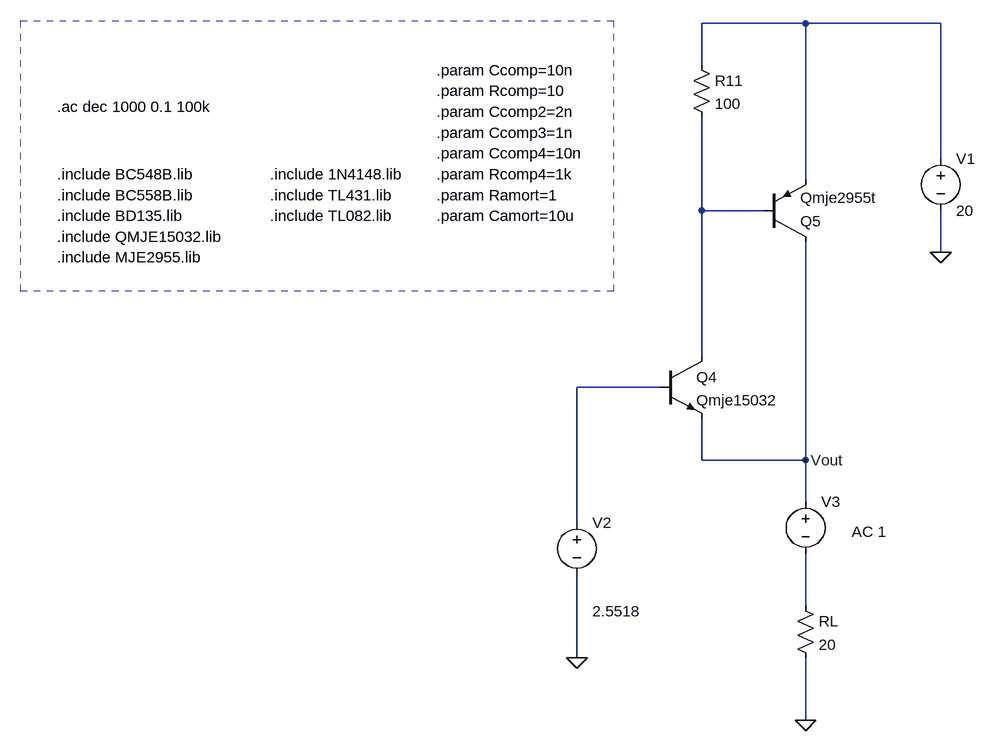
[diagram p0: schematic power_supply_P05.3.asc]
power_supply_P05.3.asc, the LTspice schematic file:
Version 4
SHEET 1 3040 1240
WIRE -384 -752 -544 -752
WIRE -176 -752 -384 -752
WIRE -544 -688 -544 -752
WIRE -176 -544 -176 -752
WIRE -384 -512 -384 -752
WIRE -544 -464 -544 -608
WIRE -448 -464 -544 -464
WIRE -176 -400 -176 -464
WIRE -544 -240 -544 -464
WIRE -608 -192 -736 -192
WIRE -544 -80 -544 -144
WIRE -384 -80 -384 -416
WIRE -384 -80 -544 -80
WIRE -384 -16 -384 -80
WIRE -736 16 -736 -192
WIRE -384 144 -384 64
WIRE -736 224 -736 96
WIRE -384 320 -384 224
FLAG -176 -400 0
FLAG -384 320 0
FLAG -736 224 0
FLAG -384 -80 Vout
DATAFLAG -544 -496 ""
DATAFLAG -384 -160 ""
DATAFLAG -384 -368 "Ic(Q5)"
DATAFLAG -544 -320 "Ic(Q4)"
DATAFLAG -384 -560 "$"
DATAFLAG -384 128 "I(Rl)"
SYMBOL res -400 128 R0
SYMATTR InstName RL
SYMATTR Value 20
SYMBOL pnp -448 -416 M180
SYMATTR InstName Q5
SYMATTR Value Qmje2955t
SYMBOL voltage -176 -560 R0
SYMATTR InstName V1
SYMATTR Value 20
SYMBOL res -560 -704 R0
SYMATTR InstName R11
SYMATTR Value 100
SYMBOL npn -608 -240 R0
SYMATTR InstName Q4
SYMATTR Value Qmje15032
SYMBOL voltage -736 0 R0
WINDOW 3 24 152 Left 2
WINDOW 123 24 124 Left 2
WINDOW 39 0 0 Left 0
SYMATTR Value 2.5518
SYMATTR InstName V2
SYMBOL voltage -384 -32 R0
WINDOW 3 24 152 Left 2
WINDOW 123 71 62 Left 2
WINDOW 39 0 0 Left 0
SYMATTR Value ""
SYMATTR Value2 AC 1
SYMATTR InstName V3
TEXT -1536 -488 Left 2 !.include BC558B.lib
TEXT -1208 -456 Left 2 !.include TL082.lib
TEXT -1536 -520 Left 2 !.include BC548B.lib
TEXT -1536 -392 Left 2 !.include MJE2955.lib
TEXT -1536 -456 Left 2 !.include BD135.lib
TEXT -1208 -520 Left 2 !.include 1N4148.lib
TEXT -1208 -488 Left 2 !.include TL431.lib
TEXT -1536 -424 Left 2 !.include QMJE15032.lib
TEXT -1536 -624 Left 2 !.ac dec 1000 0.1 100k
TEXT -952 -680 Left 2 !.param Ccomp=10n
TEXT -952 -648 Left 2 !.param Rcomp=10
TEXT -952 -616 Left 2 !.param Ccomp2=2n
TEXT -952 -584 Left 2 !.param Ccomp3=1n
TEXT -952 -552 Left 2 !.param Ccomp4=10n
TEXT -952 -488 Left 2 !.param Ramort=1
TEXT -952 -456 Left 2 !.param Camort=10u
TEXT -952 -520 Left 2 !.param Rcomp4=1k
RECTANGLE Normal -680 -340 -1592 -756 1

The netlist it stands for:
* power_supply_P05.3.asc
RL N004 0 20
Q5 Vout N002 N001 0 Qmje2955t
V1 N001 0 20
R11 N001 N002 100
Q4 N002 N003 Vout 0 Qmje15032
V2 N003 0 2.5518
V3 Vout N004 AC 1
.model NPN NPN
.model PNP PNP
.lib standard.bjt
.include BC558B.lib
.include TL082.lib
.include BC548B.lib
.include MJE2955.lib
.include BD135.lib
.include 1N4148.lib
.include TL431.lib
.include QMJE15032.lib
.ac dec 1000 0.1 100k
.param Ccomp=10n
.param Rcomp=10
.param Ccomp2=2n
.param Ccomp3=1n
.param Ccomp4=10n
.param Ramort=1
.param Camort=10u
.param Rcomp4=1k
.backanno
.end